# Altium schematic sheet kicanka_PCB.SchDoc
size A3
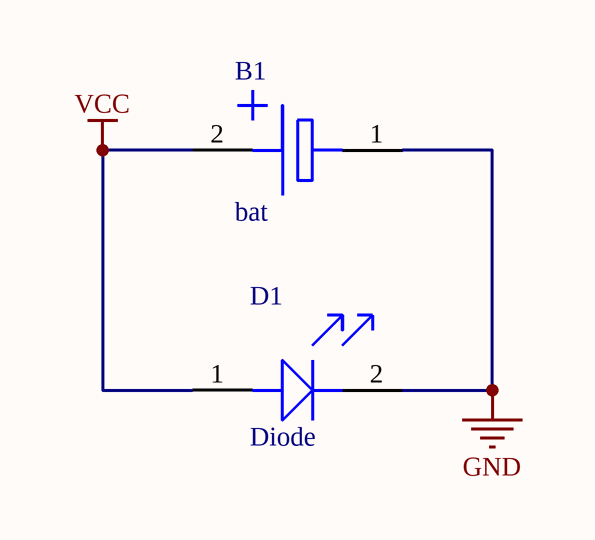
[diagram p0: kicanka_PCB.SchDoc]

## Parts
B1  bat  [bat]
D1  Diode  [LED]

## Nets
GND: B1.1 D1.2
VCC: B1.2 D1.1